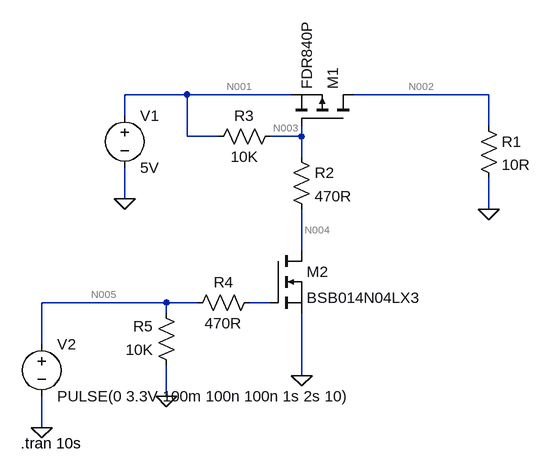
[diagram p0: schematic Enable_Circuit.asc]
Enable_Circuit.asc, the LTspice schematic file:
Version 4.1
SHEET 1 880 680
WIRE 16 -16 -80 -16
WIRE 176 -16 16 -16
WIRE 480 -16 272 -16
WIRE -80 16 -80 -16
WIRE 480 32 480 -16
WIRE 16 48 16 -16
WIRE 64 48 16 48
WIRE 192 48 192 32
WIRE 192 48 144 48
WIRE 192 80 192 48
WIRE -80 144 -80 96
WIRE 480 160 480 112
WIRE 192 224 192 160
WIRE -16 304 -208 304
WIRE 32 304 -16 304
WIRE 144 304 112 304
WIRE -16 320 -16 304
WIRE -208 368 -208 304
WIRE 192 416 192 320
WIRE -16 448 -16 400
WIRE -208 496 -208 448
FLAG 480 160 0
FLAG -80 144 0
FLAG -208 496 0
FLAG -16 448 0
FLAG 192 416 0
SYMBOL lib\\sym\\pmos 272 32 M270
SYMATTR InstName M1
SYMATTR Value FDR840P
SYMBOL voltage -80 0 R0
WINDOW 123 0 0 Left 0
WINDOW 39 0 0 Left 0
SYMATTR InstName V1
SYMATTR Value 5V
SYMBOL res 464 16 R0
SYMATTR InstName R1
SYMATTR Value 10R
SYMBOL voltage -208 352 R0
WINDOW 123 0 0 Left 0
WINDOW 39 0 0 Left 0
SYMATTR InstName V2
SYMATTR Value PULSE(0 3.3V 100m 100n 100n 1s 2s 10)
SYMBOL lib\\sym\\nmos 144 224 R0
SYMATTR InstName M2
SYMATTR Value BSB014N04LX3
SYMBOL res 176 64 R0
SYMATTR InstName R2
SYMATTR Value 470R
SYMBOL res 160 32 R90
WINDOW 0 0 56 VBottom 2
WINDOW 3 32 56 VTop 2
SYMATTR InstName R3
SYMATTR Value 10K
SYMBOL res 128 288 R90
WINDOW 0 0 56 VBottom 2
WINDOW 3 32 56 VTop 2
SYMATTR InstName R4
SYMATTR Value 470R
SYMBOL res 0 416 R180
WINDOW 0 36 76 Left 2
WINDOW 3 36 40 Left 2
SYMATTR InstName R5
SYMATTR Value 10K
TEXT -240 520 Left 2 !.tran 10s

The netlist it stands for:
* Enable_Circuit.asc
M1 N002 N003 N001 N001 FDR840P
V1 N001 0 5V
R1 N002 0 10R
V2 N005 0 PULSE(0 3.3V 100m 100n 100n 1s 2s 10)
M2 N004 N006 0 0 BSB014N04LX3
R2 N003 N004 470R
R3 N003 N001 10K
R4 N006 N005 470R
R5 0 N005 10K
.model NMOS NMOS
.model PMOS PMOS
.lib standard.mos
.tran 10s
.backanno
.end

* Results of the author's LTspice run, read from the files saved beside the schematic
* Operating Point, zero values left out:
*   V(n003) = 5 V
*   V(n004) = 5 V
*   V(n002) = 42.8 nV
*   V(n001) = 5 V
*   Id(M1) = -4.275 nA
*   Is(M1) = 4.275 nA
*   I(R2) = 91.61 pA
*   I(R1) = 4.28 nA
*   Id(M2) = 88.04 pA
*   Is(M2) = -88.04 pA
*   I(V1) = -4.371 nA
*   I(R3) = -91.61 pA
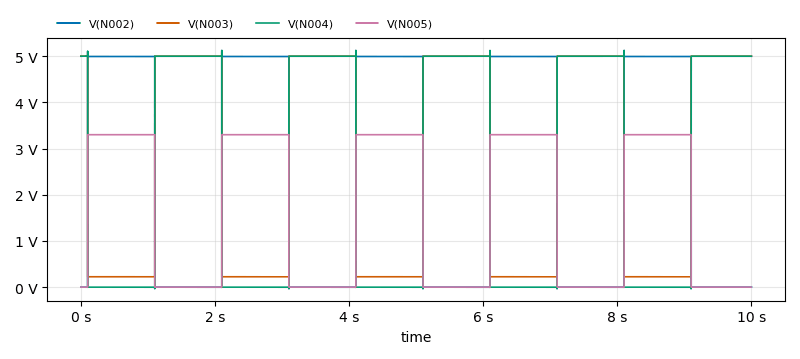
[diagram p1: Transient Analysis of Enable_Circuit.asc, plotted from the saved traces]
* Transient Analysis, 1 run:
*   V(N002): min -4.18 mV, max 4.994 V, average 2.498 V, rms 3.532 V, last 0 V
*   V(N003): min 202.9 mV, max 5.102 V, average 2.612 V, rms 3.539 V, last 5 V
*   V(N004): min -36.36 mV, max 5.126 V, average 2.5 V, rms 3.535 V, last 5 V
*   V(N005): min 0 V, max 3.3 V, average 1.65 V, rms 2.333 V, last 0 V